# Altium schematic sheet 02_B_TO_B_CON.SchDoc
size A3
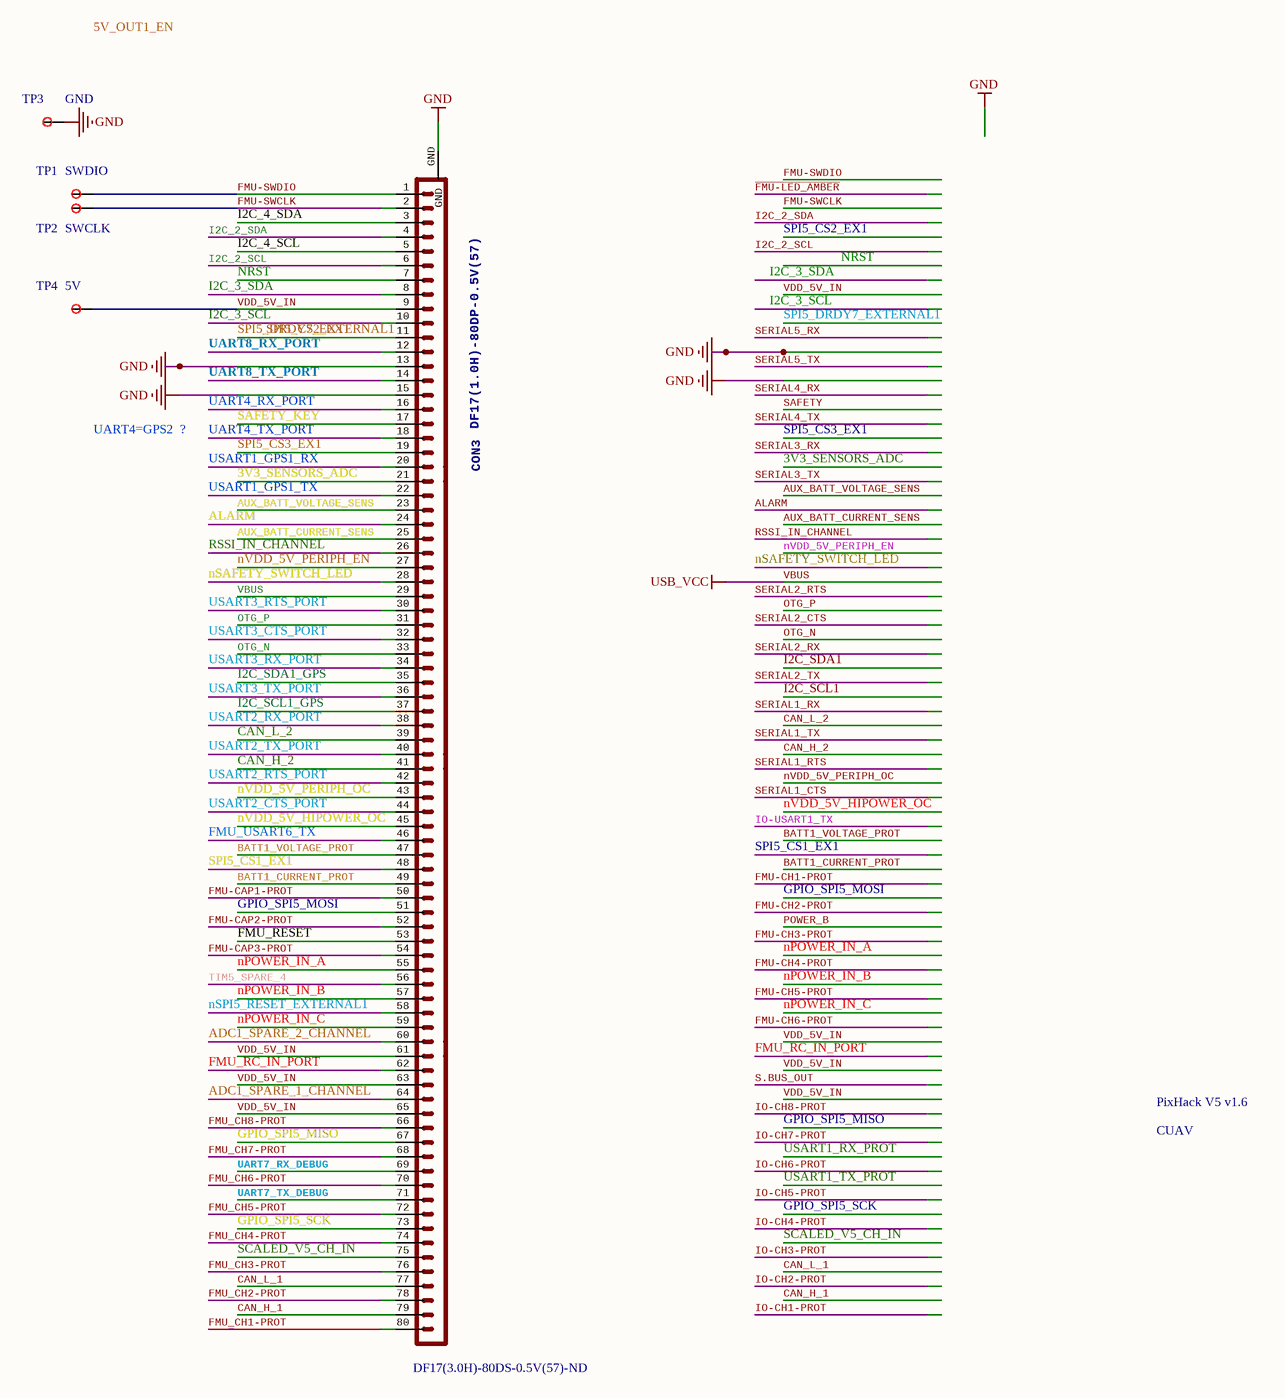
[diagram p0: 02_B_TO_B_CON.SchDoc]

## Parts
CON3  DF17(1.0H)-80DP-0.5V(57)  Supplier Part Number 1: DF17(3.0H)-80DS-0.5V(57)-ND  [DF17(1.0H)-80DP-0.5V(57)]
PixHack_V5_v1.6  CUAV  [CUAV]
TP1  SWDIO  [TP0.75]
TP2  SWCLK  [TP0.75]
TP3  GND  [TP0.75]
TP4  5V  [TP0.75]

## Nets
GND: CON3.13 CON3.15 CON3.GND TP3.0
VBUS: CON3.29  [also labelled USB_VCC]
3V3_SENSORS_ADC: CON3.21
ADC1_SPARE_1_CHANNEL: CON3.64
ADC1_SPARE_2_CHANNEL: CON3.60
ALARM: CON3.24
AUX_BATT_CURRENT_SENS: CON3.25
AUX_BATT_VOLTAGE_SENS: CON3.23
BATT1_CURRENT_PROT: CON3.49
BATT1_VOLTAGE_PROT: CON3.47
CAN_H_1: CON3.79
CAN_H_2: CON3.41
CAN_L_1: CON3.77
CAN_L_2: CON3.39
FMU-CAP1-PROT: CON3.50
FMU-CAP2-PROT: CON3.52
FMU-CAP3-PROT: CON3.54
FMU-SWCLK: CON3.2 TP2.0
FMU-SWDIO: CON3.1 TP1.0
FMU_CH1-PROT: CON3.80
FMU_CH2-PROT: CON3.78
FMU_CH3-PROT: CON3.76
FMU_CH4-PROT: CON3.74
FMU_CH5-PROT: CON3.72
FMU_CH6-PROT: CON3.70
FMU_CH7-PROT: CON3.68
FMU_CH8-PROT: CON3.66
FMU_RC_IN_PORT: CON3.62
FMU_RESET: CON3.53
FMU_USART6_TX: CON3.46
GPIO_SPI5_MISO: CON3.67
GPIO_SPI5_MOSI: CON3.51
GPIO_SPI5_SCK: CON3.73
I2C_2_SCL: CON3.6
I2C_2_SDA: CON3.4
I2C_3_SCL: CON3.10
I2C_3_SDA: CON3.8
I2C_4_SCL: CON3.5
I2C_4_SDA: CON3.3
I2C_SCL1_GPS: CON3.37
I2C_SDA1_GPS: CON3.35
nPOWER_IN_A: CON3.55
nPOWER_IN_B: CON3.57
nPOWER_IN_C: CON3.59
NRST: CON3.7
nSAFETY_SWITCH_LED: CON3.28
nSPI5_RESET_EXTERNAL1: CON3.58
nVDD_5V_HIPOWER_OC: CON3.45
nVDD_5V_PERIPH_EN: CON3.27
nVDD_5V_PERIPH_OC: CON3.43
OTG_N: CON3.33
OTG_P: CON3.31
RSSI_IN_CHANNEL: CON3.26
SAFETY_KEY: CON3.17
SCALED_V5_CH_IN: CON3.75
SPI5_CS1_EX1: CON3.48
SPI5_CS2_EX1: CON3.11  [also labelled SPI5_DRDY7_EXTERNAL1]
SPI5_CS3_EX1: CON3.19
TIM5_SPARE_4: CON3.56
UART4_RX_PORT: CON3.16
UART4_TX_PORT: CON3.18
UART7_RX_DEBUG: CON3.69
UART7_TX_DEBUG: CON3.71
UART8_RX_PORT: CON3.12
UART8_TX_PORT: CON3.14
USART1_GPS1_RX: CON3.20
USART1_GPS1_TX: CON3.22
USART2_CTS_PORT: CON3.44
USART2_RTS_PORT: CON3.42
USART2_RX_PORT: CON3.38
USART2_TX_PORT: CON3.40
USART3_CTS_PORT: CON3.32
USART3_RTS_PORT: CON3.30
USART3_RX_PORT: CON3.34
USART3_TX_PORT: CON3.36
VDD_5V_IN: CON3.9 CON3.61 CON3.63 CON3.65 TP4.0

## Notes on the sheet
- Labels drawn without touching a wire or pin: 5V_OUT1_EN, UART4=GPS2  ?

## Library data of the parts
CON3 = CON-DF17-80F: CONN RECEPT 80POS .5MM SMD W/FIT; 3DR_PARTNO: ECM0518; PARTNO: DF17(3.0H)-80DS-0.5V(57); Supplier 1: Digi-Key
TP1-TP4 = TP_0.75: TP_0.75MM